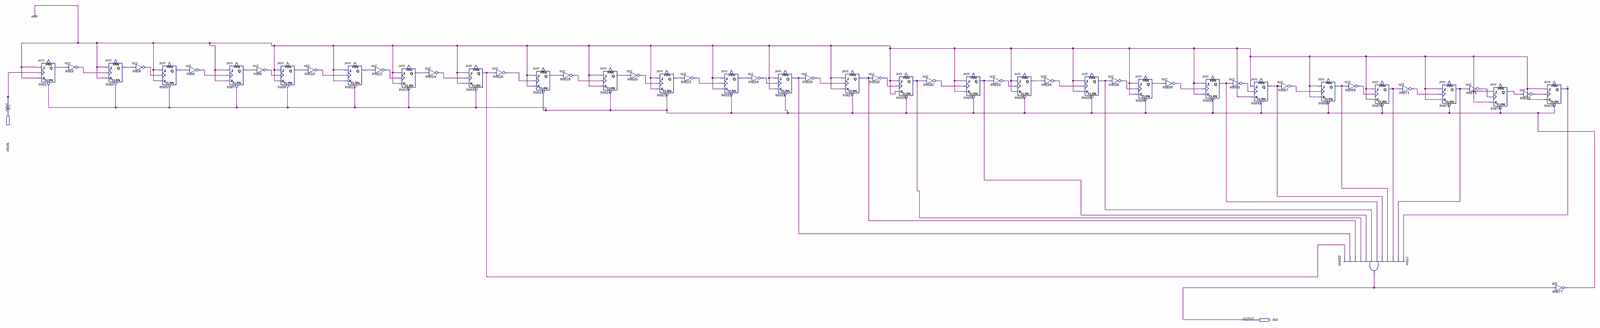
[diagram p0: schematic sheet, whole]
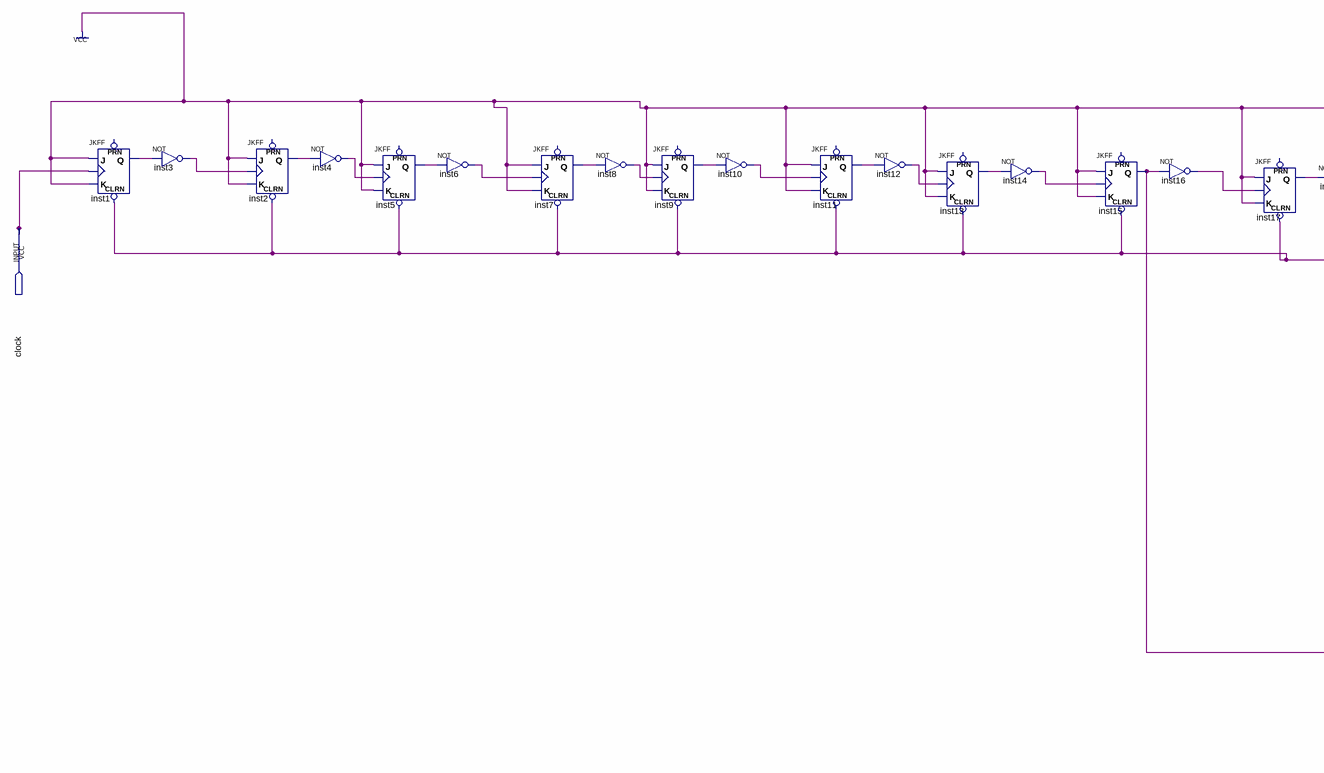
[diagram p1: schematic sheet, left part]
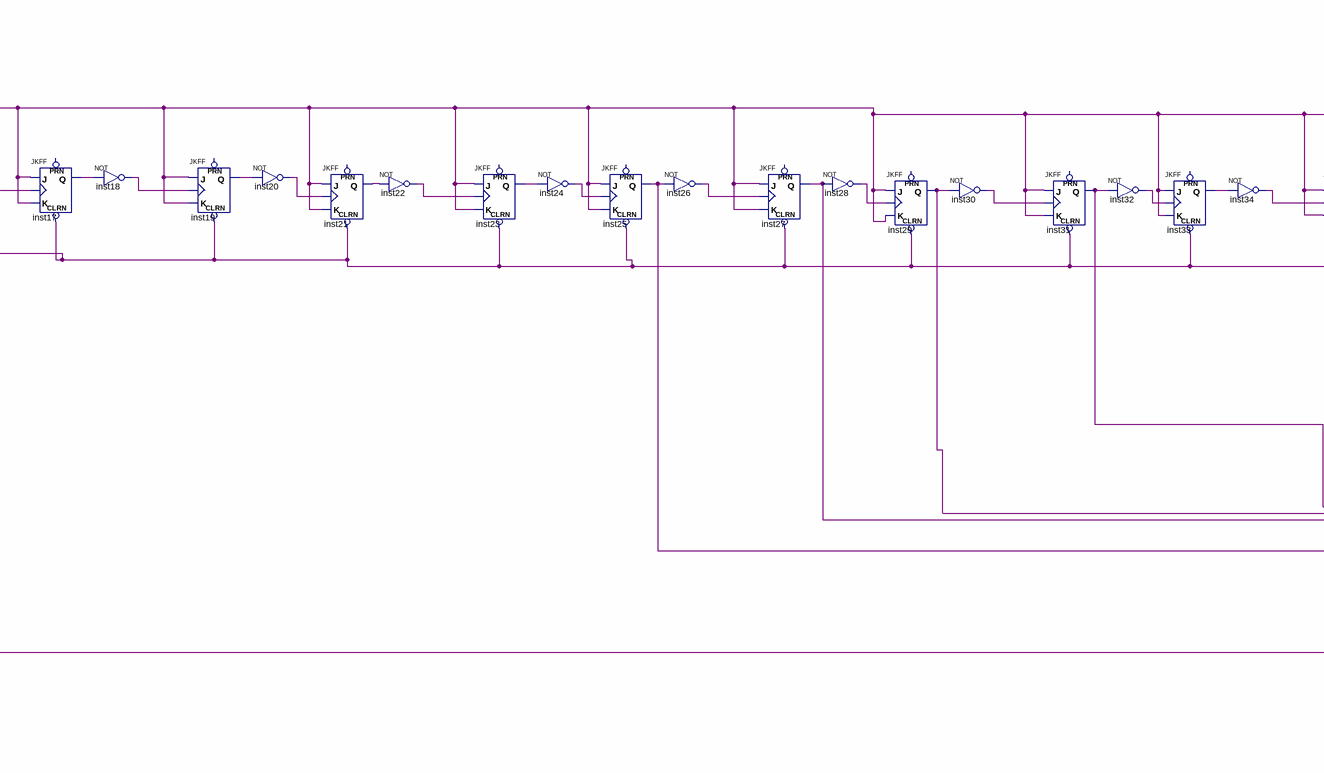
[diagram p2: schematic sheet, centre part]
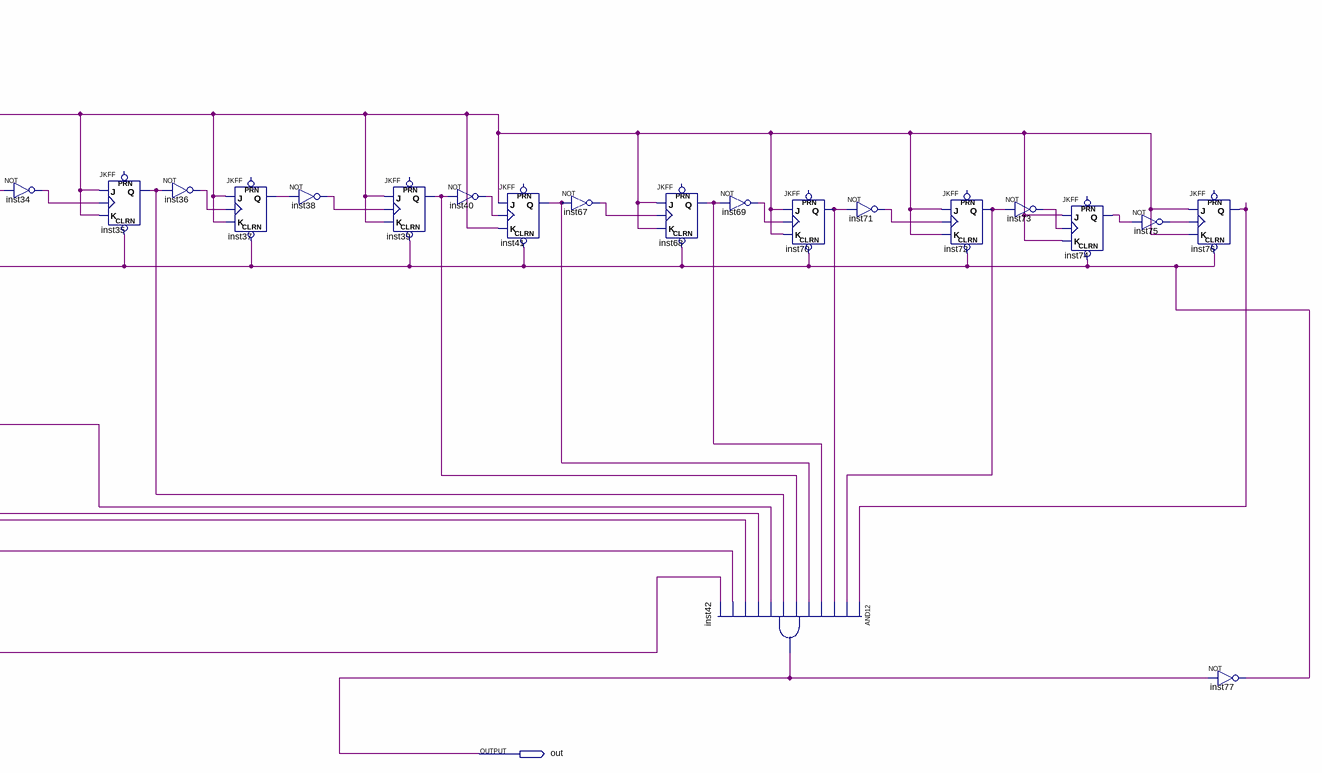
[diagram p3: schematic sheet, right part]
// Quartus schematic divisor.bdf as structural Verilog: 53 symbols, 2 pins
module divisor (
  input  clock,
  output out
);

  wire inst1_q, inst2_q, inst3_out, inst4_out, inst5_q, inst6_out, inst7_q, inst8_out, inst9_q, inst10_out,
       inst11_q, inst12_out, inst13_q, inst14_out, inst15_q, inst16_out, inst17_q, inst18_out, inst19_q,
       inst20_out, inst21_q, inst22_out, inst23_q, inst24_out, inst25_q, inst26_out, inst27_q, inst28_out,
       inst29_q, inst30_out, inst31_q, inst32_out, inst33_q, inst34_out, inst35_q, inst36_out, inst37_q,
       inst38_out, inst39_q, inst40_out, inst41_q, inst67_out, inst68_q, inst69_out, inst70_q, inst71_out,
       inst72_q, inst73_out, inst74_q, inst75_out, inst76_q, inst77_out;

  JKFF inst1 (.CLRN(inst77_out), .K(1'b1), .J(1'b1), .CLK(clock), .Q(inst1_q));  // open: PRN
  not inst3 (inst3_out, inst1_q);
  JKFF inst2 (.CLRN(inst77_out), .K(1'b1), .J(1'b1), .CLK(inst3_out), .Q(inst2_q));  // open: PRN
  not inst4 (inst4_out, inst2_q);
  JKFF inst5 (.CLRN(inst77_out), .K(1'b1), .J(1'b1), .CLK(inst4_out), .Q(inst5_q));  // open: PRN
  not inst6 (inst6_out, inst5_q);
  JKFF inst7 (.CLRN(inst77_out), .K(1'b1), .J(1'b1), .CLK(inst6_out), .Q(inst7_q));  // open: PRN
  not inst8 (inst8_out, inst7_q);
  JKFF inst9 (.CLRN(inst77_out), .K(1'b1), .J(1'b1), .CLK(inst8_out), .Q(inst9_q));  // open: PRN
  not inst10 (inst10_out, inst9_q);
  JKFF inst11 (.CLRN(inst77_out), .K(1'b1), .J(1'b1), .CLK(inst10_out), .Q(inst11_q));  // open: PRN
  not inst12 (inst12_out, inst11_q);
  JKFF inst13 (.CLRN(inst77_out), .K(1'b1), .J(1'b1), .CLK(inst12_out), .Q(inst13_q));  // open: PRN
  not inst14 (inst14_out, inst13_q);
  JKFF inst15 (.CLRN(inst77_out), .K(1'b1), .J(1'b1), .CLK(inst14_out), .Q(inst15_q));  // open: PRN
  not inst16 (inst16_out, inst15_q);
  JKFF inst17 (.CLRN(inst77_out), .K(1'b1), .J(1'b1), .CLK(inst16_out), .Q(inst17_q));  // open: PRN
  not inst18 (inst18_out, inst17_q);
  JKFF inst19 (.CLRN(inst77_out), .K(1'b1), .J(1'b1), .CLK(inst18_out), .Q(inst19_q));  // open: PRN
  not inst20 (inst20_out, inst19_q);
  JKFF inst21 (.CLRN(inst77_out), .K(1'b1), .J(1'b1), .CLK(inst20_out), .Q(inst21_q));  // open: PRN
  not inst22 (inst22_out, inst21_q);
  JKFF inst23 (.CLRN(inst77_out), .K(1'b1), .J(1'b1), .CLK(inst22_out), .Q(inst23_q));  // open: PRN
  not inst24 (inst24_out, inst23_q);
  JKFF inst25 (.CLRN(inst77_out), .K(1'b1), .J(1'b1), .CLK(inst24_out), .Q(inst25_q));  // open: PRN
  not inst26 (inst26_out, inst25_q);
  JKFF inst27 (.CLRN(inst77_out), .K(1'b1), .J(1'b1), .CLK(inst26_out), .Q(inst27_q));  // open: PRN
  not inst28 (inst28_out, inst27_q);
  JKFF inst29 (.CLRN(inst77_out), .K(1'b1), .J(1'b1), .CLK(inst28_out), .Q(inst29_q));  // open: PRN
  not inst30 (inst30_out, inst29_q);
  JKFF inst31 (.CLRN(inst77_out), .K(1'b1), .J(1'b1), .CLK(inst30_out), .Q(inst31_q));  // open: PRN
  not inst32 (inst32_out, inst31_q);
  JKFF inst33 (.CLRN(inst77_out), .K(1'b1), .J(1'b1), .CLK(inst32_out), .Q(inst33_q));  // open: PRN
  not inst34 (inst34_out, inst33_q);
  JKFF inst35 (.CLRN(inst77_out), .K(1'b1), .J(1'b1), .CLK(inst34_out), .Q(inst35_q));  // open: PRN
  not inst36 (inst36_out, inst35_q);
  JKFF inst37 (.CLRN(inst77_out), .K(1'b1), .J(1'b1), .CLK(inst36_out), .Q(inst37_q));  // open: PRN
  not inst38 (inst38_out, inst37_q);
  JKFF inst39 (.CLRN(inst77_out), .K(1'b1), .J(1'b1), .CLK(inst38_out), .Q(inst39_q));  // open: PRN
  not inst40 (inst40_out, inst39_q);
  JKFF inst41 (.CLRN(inst77_out), .K(1'b1), .J(1'b1), .CLK(inst40_out), .Q(inst41_q));  // open: PRN
  not inst67 (inst67_out, inst41_q);
  JKFF inst68 (.CLRN(inst77_out), .K(1'b1), .J(1'b1), .CLK(inst67_out), .Q(inst68_q));  // open: PRN
  not inst69 (inst69_out, inst68_q);
  and inst42 (out, inst76_q, inst72_q, inst70_q, inst68_q, inst41_q, inst39_q, inst35_q, inst31_q, inst29_q, inst27_q, inst25_q, inst15_q);
  JKFF inst70 (.CLRN(inst77_out), .K(1'b1), .J(1'b1), .CLK(inst69_out), .Q(inst70_q));  // open: PRN
  not inst71 (inst71_out, inst70_q);
  JKFF inst72 (.CLRN(inst77_out), .K(1'b1), .J(1'b1), .CLK(inst71_out), .Q(inst72_q));  // open: PRN
  not inst73 (inst73_out, inst72_q);
  JKFF inst74 (.CLRN(inst77_out), .K(1'b1), .J(1'b1), .CLK(inst73_out), .Q(inst74_q));  // open: PRN
  not inst75 (inst75_out, inst74_q);
  JKFF inst76 (.CLRN(inst77_out), .K(1'b1), .J(1'b1), .CLK(inst75_out), .Q(inst76_q));  // open: PRN
  not inst77 (inst77_out, out);
endmodule
